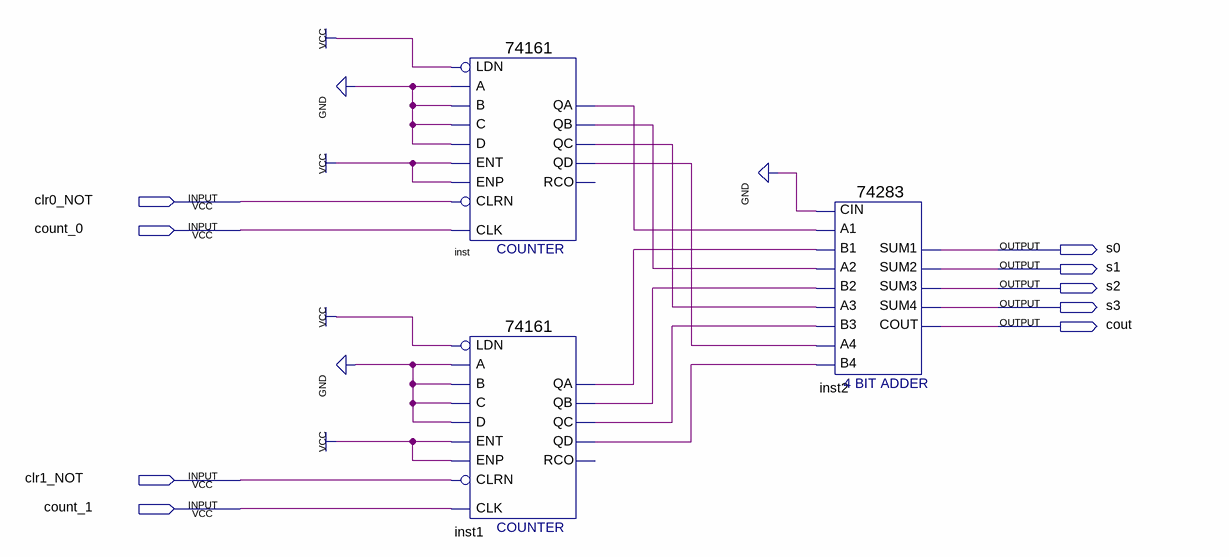
[diagram p0: schematic sheet]
// Quartus schematic binary_counter_adder_4bit.bdf as structural Verilog: 3 symbols, 9 pins
module binary_counter_adder_4bit (
  input  clr0_NOT,
  input  count_0,
  input  clr1_NOT,
  input  count_1,
  output s0,
  output s1,
  output s2,
  output s3,
  output cout
);

  wire inst1_qa, inst1_qb, inst1_qc, inst1_qd, inst_qa, inst_qb, inst_qc, inst_qd;

  \74161  inst (
    .CLRN(clr0_NOT), .CLK(count_0), .ENP(1'b1), .LDN(1'b1), .A(1'b0), .D(1'b0), .ENT(1'b1), .B(1'b0),
    .C(1'b0), .QD(inst_qd), .QC(inst_qc), .QB(inst_qb), .QA(inst_qa));  // open: RCO
  \74161  inst1 (
    .CLRN(clr1_NOT), .CLK(count_1), .ENP(1'b1), .LDN(1'b1), .A(1'b0), .D(1'b0), .ENT(1'b1), .B(1'b0),
    .C(1'b0), .QD(inst1_qd), .QC(inst1_qc), .QB(inst1_qb), .QA(inst1_qa));  // open: RCO
  \74283  inst2 (
    .CIN(1'b0), .A1(inst_qa), .A2(inst_qb), .B2(inst1_qb), .A3(inst_qc), .A4(inst_qd), .B4(inst1_qd),
    .B1(inst1_qa), .B3(inst1_qc), .SUM4(s3), .COUT(cout), .SUM1(s0), .SUM2(s1), .SUM3(s2));
endmodule
